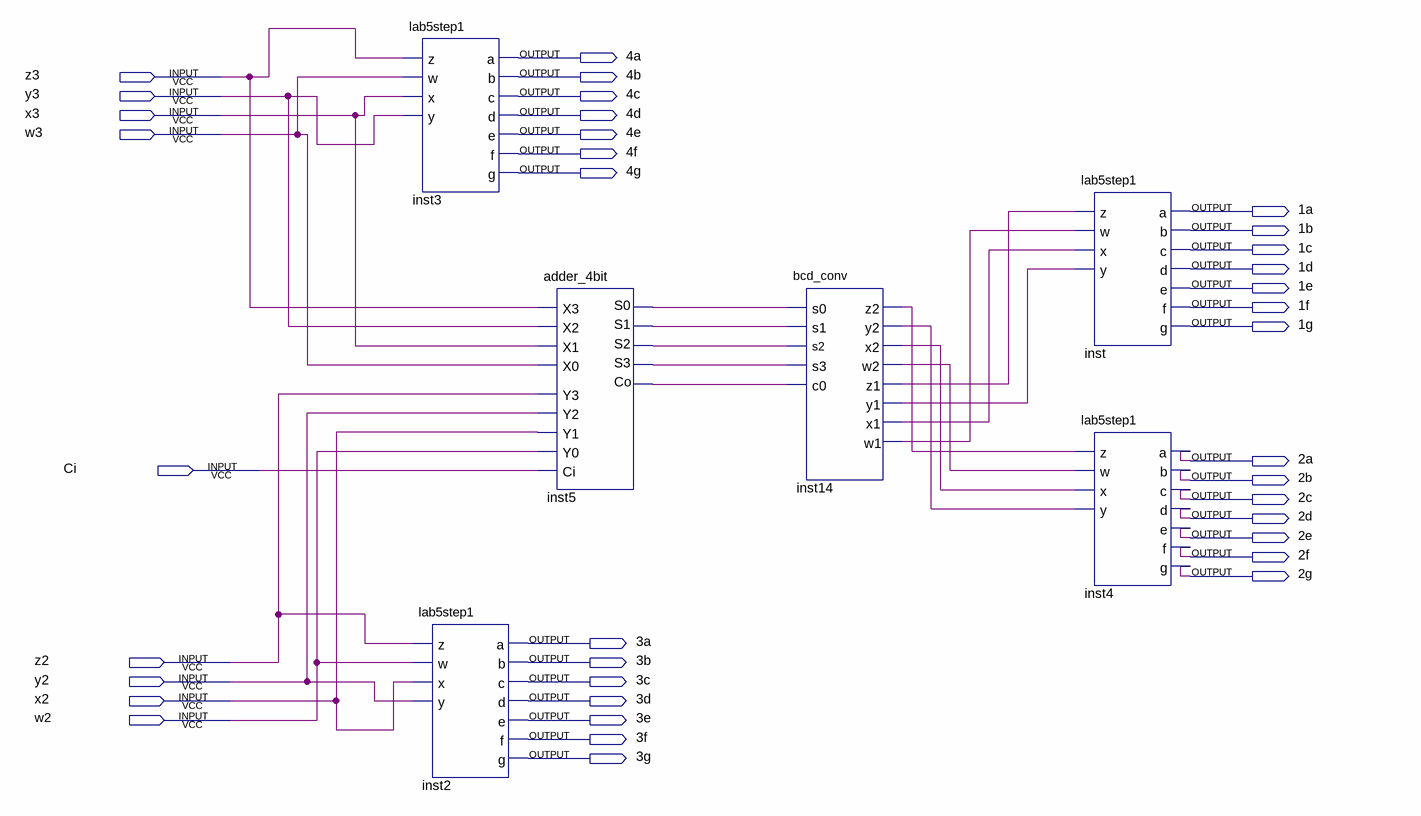
[diagram p0: schematic sheet]
// Quartus schematic lab06step1.bdf as structural Verilog: 6 symbols, 37 pins
module lab06step1 (
  input  z3,
  input  y3,
  input  x3,
  input  w3,
  input  Ci,
  input  z2,
  input  y2,
  input  x2,
  input  w2,
  output \4a ,
  output \4b ,
  output \4c ,
  output \4d ,
  output \4e ,
  output \4f ,
  output \4g ,
  output \1a ,
  output \1b ,
  output \1c ,
  output \1d ,
  output \1e ,
  output \1f ,
  output \1g ,
  output \2a ,
  output \2b ,
  output \2c ,
  output \2d ,
  output \2e ,
  output \2f ,
  output \2g ,
  output \3a ,
  output \3b ,
  output \3c ,
  output \3d ,
  output \3e ,
  output \3f ,
  output \3g 
);

  wire inst5_co, inst5_s0, inst5_s1, inst5_s2, inst5_s3, inst14_w1, inst14_w2, inst14_x1, inst14_x2,
       inst14_y1, inst14_y2, inst14_z1, inst14_z2;

  lab5step1 inst3 (
    .z(z3), .w(w3), .x(x3), .y(y3), .a(\4a ), .b(\4b ), .c(\4c ), .d(\4d ), .e(\4e ), .f(\4f ), .g(\4g ));
  lab5step1 inst2 (
    .z(z2), .w(w2), .x(x2), .y(y2), .a(\3a ), .b(\3b ), .c(\3c ), .d(\3d ), .e(\3e ), .f(\3f ), .g(\3g ));
  adder_4bit inst5 (
    .X3(z3), .Y3(z2), .X2(y3), .Y2(y2), .X1(x3), .Y1(x2), .X0(w3), .Y0(w2), .Ci(Ci), .S0(inst5_s0),
    .S1(inst5_s1), .S2(inst5_s2), .S3(inst5_s3), .Co(inst5_co));
  bcd_conv inst14 (
    .s2(inst5_s2), .s0(inst5_s0), .s1(inst5_s1), .s3(inst5_s3), .c0(inst5_co), .z2(inst14_z2),
    .y2(inst14_y2), .x2(inst14_x2), .w2(inst14_w2), .z1(inst14_z1), .y1(inst14_y1), .x1(inst14_x1),
    .w1(inst14_w1));
  lab5step1 inst (
    .z(inst14_z1), .w(inst14_w1), .x(inst14_x1), .y(inst14_y1), .a(\1a ), .b(\1b ), .c(\1c ), .d(\1d ),
    .e(\1e ), .f(\1f ), .g(\1g ));
  lab5step1 inst4 (
    .z(inst14_z2), .w(inst14_w2), .x(inst14_x2), .y(inst14_y2), .a(\2a ), .b(\2b ), .c(\2c ), .d(\2d ),
    .e(\2e ), .f(\2f ), .g(\2g ));
endmodule
